# EAGLE design solar datalogger workshop (EAGLE 9.3.0)
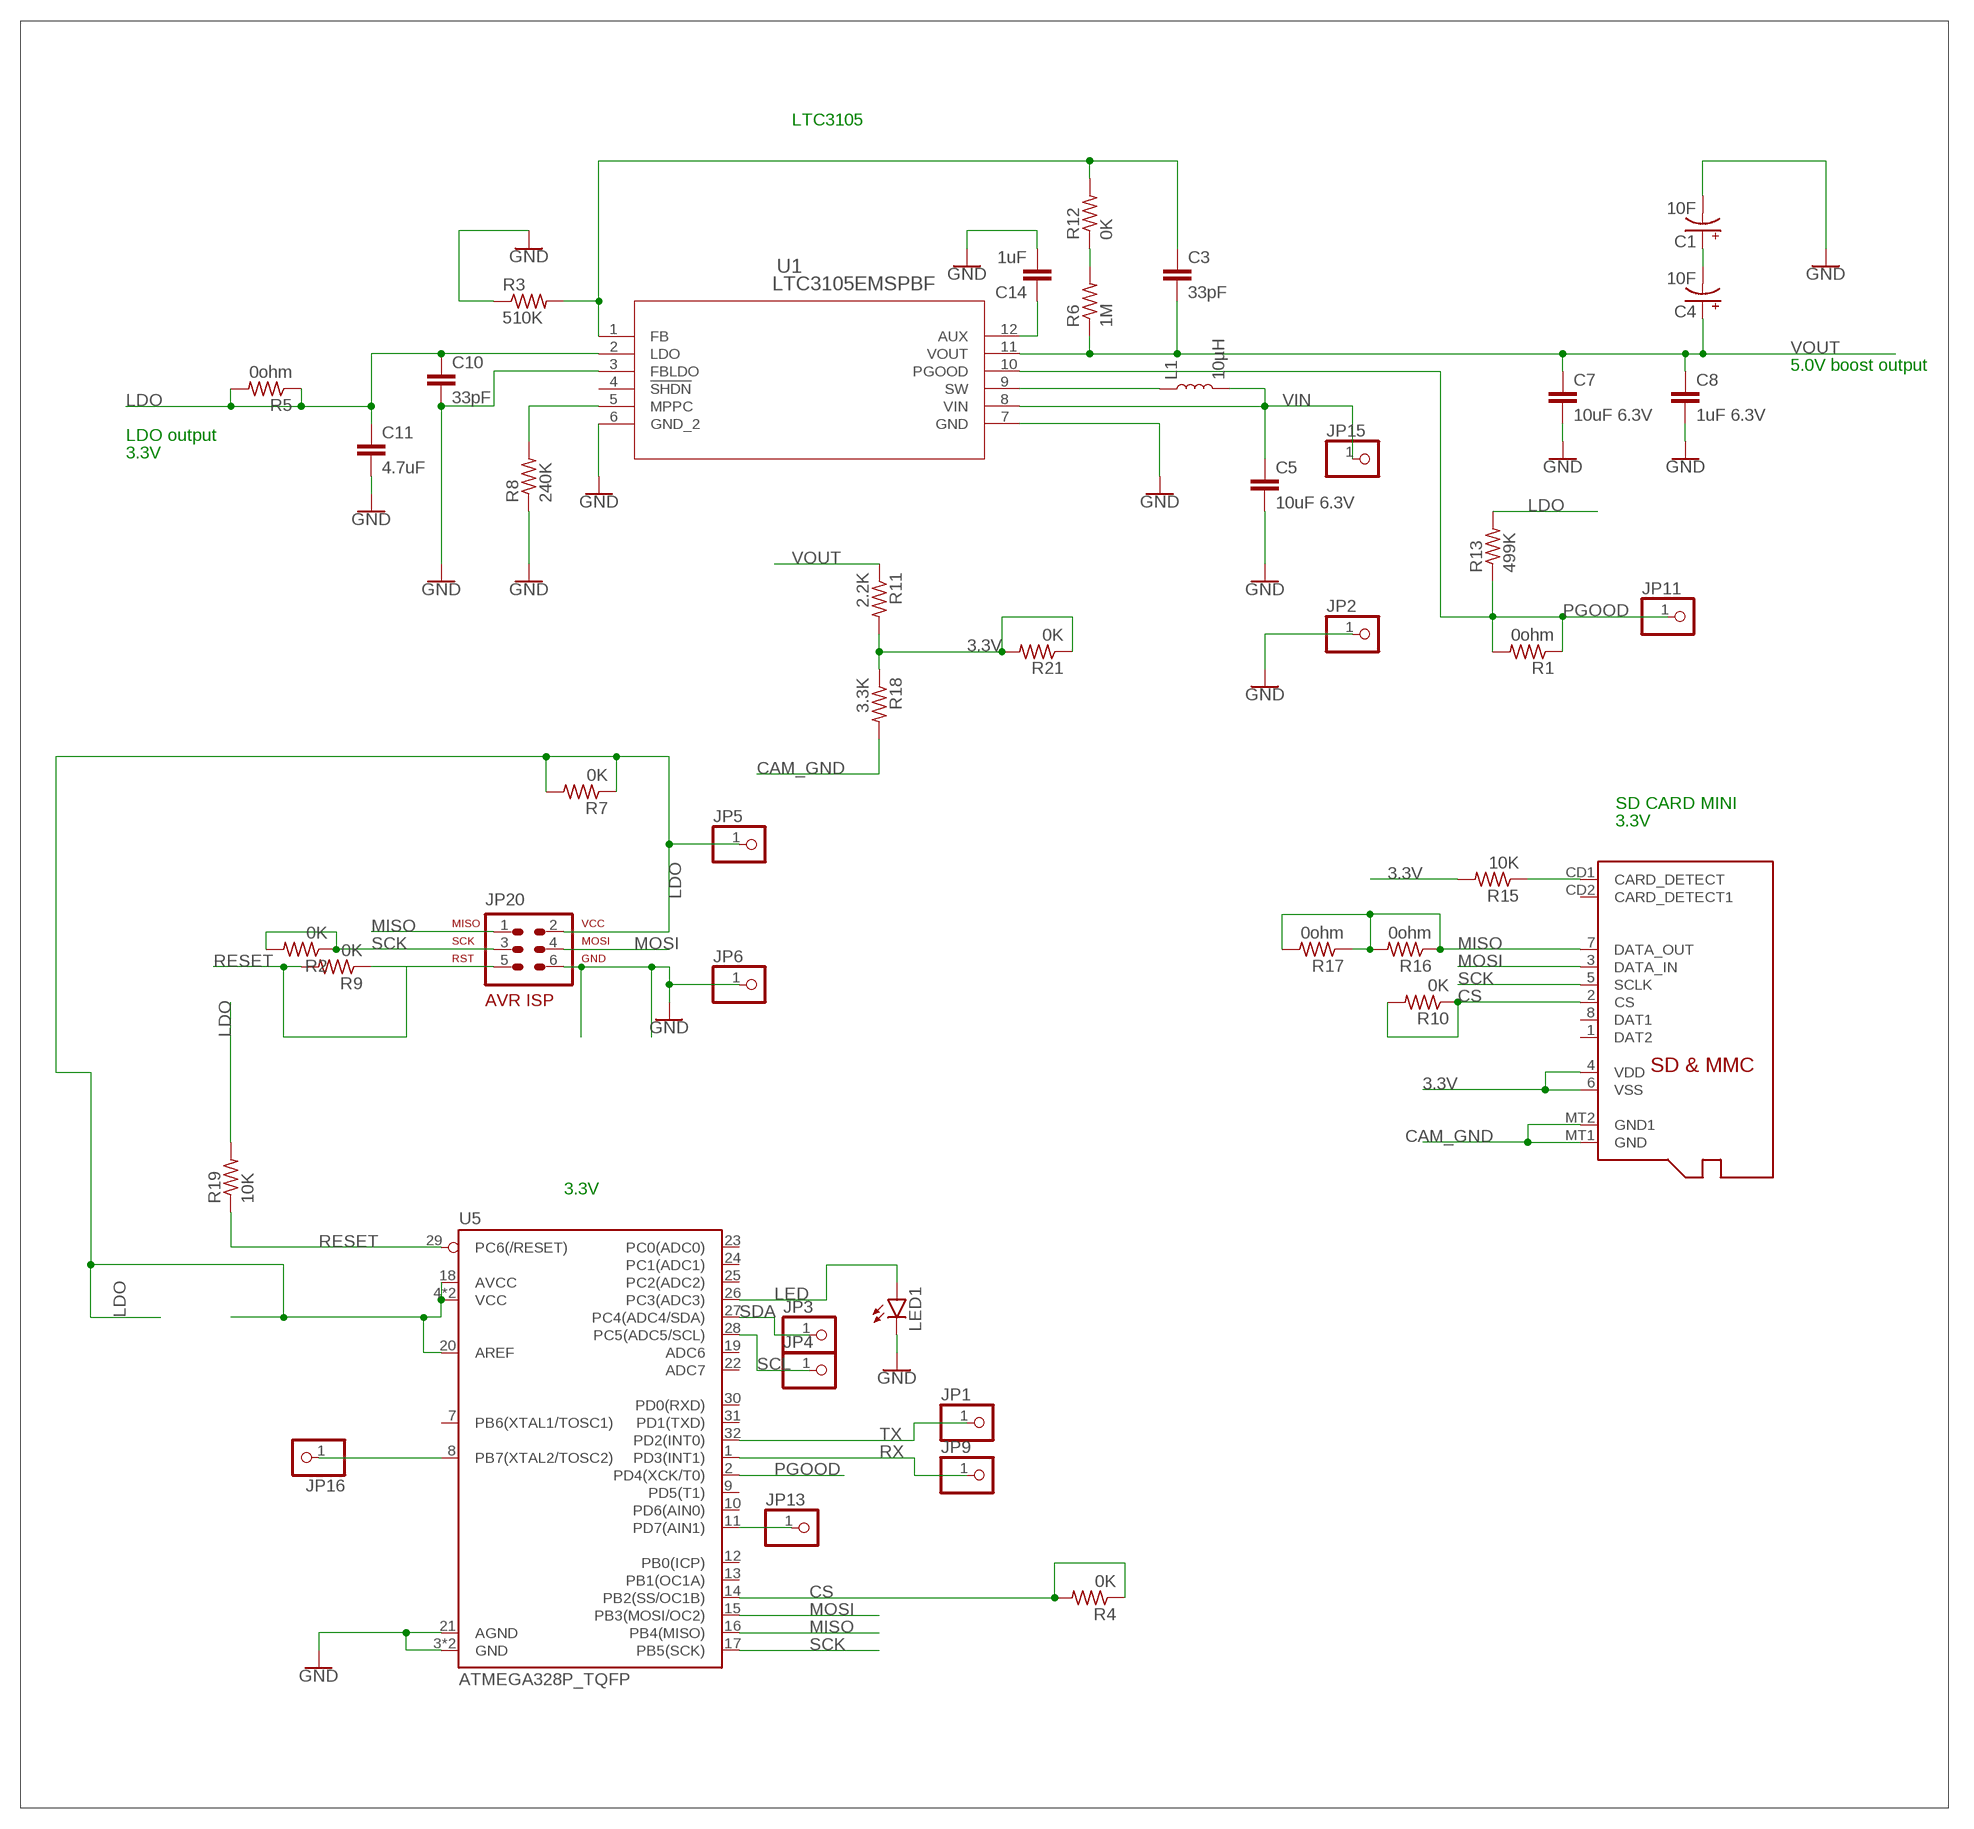
[diagram p0: schematic, sheet 1]

## Parts
C1  10F  1F-EDLC  [CAP-RADIAL-5MM-21.5MM]
C3  33pF  2.2UF-1206-50V-10%  [1206]
C4  10F  1F-EDLC  [CAP-RADIAL-5MM-21.5MM]
C5  10uF 6.3V  2.2UF-1206-50V-10%  [1206]
C7  10uF 6.3V  2.2UF-1206-50V-10%  [1206]
C8  1uF 6.3V  2.2UF-1206-50V-10%  [1206]
C10  33pF  2.2UF-1206-50V-10%  [1206]
C11  4.7uF  2.2UF-1206-50V-10%  [1206]
C14  1uF  2.2UF-1206-50V-10%  [1206]
JP1  PINHD-1X1CB  [1X01-CLEANBIG]
JP2  PINHD-1X1CB  [1X01-CLEANBIG]
JP3  PINHD-1X1CB  [1X01-CLEANBIG]
JP4  PINHD-1X1CB  [1X01-CLEANBIG]
JP5  PINHD-1X1CB  [1X01-CLEANBIG]
JP6  PINHD-1X1CB  [1X01-CLEANBIG]
JP9  PINHD-1X1CB  [1X01-CLEANBIG]
JP11  PINHD-1X1CB  [1X01-CLEANBIG]
JP13  PINHD-1X1CB  [1X01-CLEANBIG]
JP15  PINHD-1X1CB  [1X01-CLEANBIG]
JP16  PINHD-1X1CB  [1X01-CLEANBIG]
JP20  AVR-ISP-6HORZ  [AVR-ISP-6R]
L1  10µH  INDUCTOR-VLF4012AT-2.2UH  [INDUCTOR_2.2UH]
LED1  LEDSML1206  [SML1206]
R1  0ohm  R-US_R1206  [R1206]
R2  0K  R-US_R1206  [R1206]
R3  510K  R-US_R1206  [R1206]
R4  0K  R-US_R1206  [R1206]
R5  0ohm  R-US_R1206  [R1206]
R6  1M  R-US_R1206  [R1206]
R7  0K  R-US_R1206  [R1206]
R8  240K  R-US_R1206  [R1206]
R9  0K  R-US_R1206  [R1206]
R10  0K  R-US_R1206  [R1206]
R11  2.2K  R-US_R1206  [R1206]
R12  0K  R-US_R1206  [R1206]
R13  499K  R-US_R1206  [R1206]
R15  10K  R-US_R1206  [R1206]
R16  0ohm  R-US_R1206  [R1206]
R17  0ohm  R-US_R1206  [R1206]
R18  3.3K  R-US_R1206  [R1206]
R19  10K  R-US_R1206  [R1206]
R21  0K  R-US_R1206  [R1206]
U1  LTC3105EMSPBF  [MSOP-12_MS]
U5  ATMEGA328P_TQFP  [TQFP32-08]
U$1  MICROSD  [MICROSD]

## Nets
3.3V: R11.2 R15.2 R18.1 R21.1 R21.2 U$1.4(VDD) U$1.6(VSS)
CAM_GND: R18.2 U$1.MT1(GND) U$1.MT2(GND1)
CS: R4.1 R4.2 R10.1 R10.2 U5.14(PB2(SS/OC1B)) U$1.2(CS)
GND: C1.- C5.2 C7.2 C8.2 C10.2 C11.2 C14.2 JP2.1 JP6.1 JP20.6 LED1.C R3.1 R8.1 U1.3(FBLDO) U1.6(GND_2) U1.7(GND) U5.3(GND) U5.5(GND) U5.21(AGND)
LDO: C10.1 C11.1 JP5.1 JP20.2 R5.1 R5.2 R7.1 R7.2 R13.2 R19.2 U1.2(LDO) U5.4(VCC) U5.6(VCC) U5.18(AVCC) U5.20(AREF)
LED: LED1.A U5.26(PC3(ADC3))
MISO: JP20.1 R16.1 R16.2 R17.1 R17.2 U5.16(PB4(MISO)) U$1.7(DATA_OUT)
MOSI: JP20.4 U5.15(PB3(MOSI/OC2)) U$1.3(DATA_IN)
N$1: C3.1 R3.2 R12.2 U1.1(FB)
N$2: C1.+ C4.-
N$4: L1.P$1 U1.9(SW)
N$5: C14.1 U1.12(AUX)
N$6: R8.2 U1.5(MPPC)
N$7: R6.2 R12.1
N$8: JP13.1 U5.11(PD7(AIN1))
N$11: JP16.1 U5.8(PB7(XTAL2/TOSC2))
N$16: R15.1 U$1.CD1(CARD_DETECT)
PGOOD: JP11.1 R1.1 R1.2 R13.1 U1.10(PGOOD) U5.2(PD4(XCK/T0))
RESET: JP20.5 R9.1 R9.2 R19.1 U5.29(PC6(/RESET))
RX: JP9.1 U5.1(PD3(INT1))
SCK: JP20.3 R2.1 R2.2 U5.17(PB5(SCK)) U$1.5(SCLK)
SCL: JP4.1 U5.28(PC5(ADC5/SCL))
SDA: JP3.1 U5.27(PC4(ADC4/SDA))
TX: JP1.1 U5.32(PD2(INT0))
VIN: C5.1 JP15.1 L1.P$2 U1.8(VIN)
VOUT: C3.2 C4.+ C7.1 C8.1 R6.1 R11.1 U1.11(VOUT)
Unconnected: U1.4(!SHDN) U5.7(PB6(XTAL1/TOSC1)) U5.9(PD5(T1)) U5.10(PD6(AIN0)) U5.12(PB0(ICP)) U5.13(PB1(OC1A)) U5.19(ADC6) U5.22(ADC7) U5.23(PC0(ADC0)) U5.24(PC1(ADC1)) U5.25(PC2(ADC2)) U5.30(PD0(RXD)) U5.31(PD1(TXD)) U$1.1(DAT2) U$1.8(DAT1) U$1.CD2(CARD_DETECT1)

## Notes on the sheet
- LTC3105
- 5.0V boost output
- LDO output
- 3.3V
- SD CARD MINI
- 3.3V
- 3.3V

## Library data of the parts
C1 C4 = SparkFun-Capacitors:1F-EDLC: [Eaton] [KR-5R5C105-R] - [1F Electric Double Layer Capacitor (SuperCapacitor)] This is a 21.5mm OD 1F SuperCapacitor.; PROD_ID: CAP-13904
C3 C5 C7 C8 C10 C11 C14 = SparkFun-Capacitors:2.2UF: 2.2µF ceramic capacitors A capacitor is a passive two-terminal electrical component used to store electrical energy temporarily in an electric field.; PROD_ID: CAP-10009; VALUE: 2.2uF
JP1-JP6 JP9 JP11 JP13 JP15 JP16 = adafruit:PINHD-1X1: Pin header 1x1 for 0.1" spacing With round pins
JP20 = avr-7:AVR-ISP-6: AVR ISP-6 Serial Programming Header
L1 = SparkFun-Coils:INDUCTOR: Inductors Resist changes in electrical current. Basically a coil of wire. SparkFun Products: SparkFun Load Cell Amplifier - HX711 <https://www.sparkfun.com/products/13879> IOIO-OTG - V2.2 <https://www.sparkfun.com/products/13613>; PROD_ID: NDUC-09513; VALUE: 2.2µH/±20%/1.5A
LED1 = led:LED: LED OSRAM: - CHIPLED LG R971, LG N971, LY N971, LG Q971, LY Q971, LO R971, LY R971 LH N974, LH R974 LS Q976, LO Q976, LY Q976 LO Q996 - Hyper CHIPLED LW Q18S LB Q993, LB Q99A, LB R99A - SideLED LS A670, LO A670, LY A670, LG A670, LP A670 LB A673, LV A673, LT A673, LW A673 LH A674 LY A675 LS A676, LA A676, LO A676, LY A676, LW A676 LS A679, LY A679, LG A679 - Hyper Micro SIDELED® LS Y876, LA Y876, LO Y876, LY Y876 LT Y87S - SmartLED LW L88C, LW L88S LB L89C, LB L89S, LG L890 LS L89K, LO L89K, LY L89K LS L896, LA L896, LO L896, LY L896 - TOPLED LS T670, LO T670, LY T670, LG T670, LP T670 LSG T670, LSP T670, LSY T670, LOP T670, LYG T670 LG T671, LOG T671, LSG T671 LB T673, LV T673, LT T673, LW T673 LH T674 LS T676, LA T676, LO T676, LY T676, LB T676, LH T676, LSB T676, LW T676 LB T67C, LV T67C, LT T67C, LS T67K, LO T67K, LY T67K, LW E67C LS E67B, LA E67B, LO E67B, LY E67B, LB E67C, LV E67C, LT E67C LW T67C LS T679, LY T679, LG T679 LS T770, LO T770, LY T770, LG T770, LP T770 LB T773, LV T773, LT T773, LW T773 LH T774 LS E675, LA E675, LY E675, LS T675 LS T776, LA T776, LO T776, LY T776, LB T776 LHGB T686 LT T68C, LB T68C - Hyper Mini TOPLED® LB M676 - Mini TOPLED Santana® LG M470 LS M47K, LO M47K, LY M47K Source: http://www.osram.convergy.de LUXEON: - LUMILED® LXK2-PW12-R00, LXK2-PW12-S00, LXK2-PW14-U00, LXK2-PW14-V00 LXK2-PM12-R00, LXK2-PM12-S00, LXK2-PM14-U00 LXK2-PE12-Q00, LXK2-PE12-R00, LXK2-PE12-S00, LXK2-PE14-T00, LXK2-PE14-U00 LXK2-PB12-K00, LXK2-PB12-L00, LXK2-PB12-M00, LXK2-PB14-N00, LXK2-PB14-P00, LXK2-PB14-Q00 LXK2-PR12-L00, LXK2-PR12-M00, LXK2-PR14-Q00, LXK2-PR14-R00 LXK2-PD12-Q00, LXK2-PD12-R00, LXK2-PD12-S00 LXK2-PH12-R00, LXK2-PH12-S00 LXK2-PL12-P00, LXK2-PL12-Q00, LXK2-PL12-R00 Source: www.luxeon.com KINGBRIGHT: KA-3528ASYC Source: www.kingbright.com
R1-R13 R15-R19 R21 = adafruit:R-US_: RESISTOR, American symbol
U1 = ltc 3105:LTC3105EMSPBF; MANUFACTURER_PART_NUMBER: ltc3105ems#pbf; VENDOR: Linear Technology
U5 = SparkFun-IC-Microcontroller:ATMEGA328P_TQFP: Popular 328P in QFP Storefront component: ATmega328 - TQFP <https://www.sparkfun.com/products/13448> (COM-13448) Datasheet <http://www.sparkfun.com/datasheets/Components/SMD/ATMega328.pdf> SparkFun Products SparkFun RedBoard - Programmed with Arduino <https://www.sparkfun.com/products/12757> (DEV-12757) Arduino Pro Mini 328 - 5V/16MHz <https://www.sparkfun.com/products/11113> (DEV-11113) Arduino Pro Mini 328 - 3.3V/8MHz <https://www.sparkfun.com/products/11114> (DEV-11114) SparkFun OpenLog <https://www.sparkfun.com/products/13712> (DEV-13712) SparkFun MicroView - OLED Arduino Module <https://www.sparkfun.com/products/12923> (DEV-12923) SparkFun Digital Sandbox <https://www.sparkfun.com/products/12651> (DEV-12651) SparkFun PicoBoard <https://www.sparkfun.com/products/11888> (WIG-11888) Arduino Fio <https://www.sparkfun.com/products/10116> (DEV-10116) LilyPad Arduino 328 Main Board <https://www.sparkfun.com/products/13342> (DEV-13342) SparkFun RedStick <https://www.sparkfun.com/products/13741> (DEV-13741) LilyPad MP3 <https://www.sparkfun.com/products/11013> (DEV-11013) LilyPad Arduino SimpleSnap <https://www.sparkfun.com/products/10941> (DEV-10941) SparkFun Stepoko <https://www.sparkfun.com/products/13899> (ROB-13899) SparkFun Geiger Counter <https://www.sparkfun.com/products/11345> (SEN-11345) SparkFun EL Sequencer <https://www.sparkfun.com/products/12781> (COM-12781) Arduino Pro 328 - 5V/16MHz <https://www.sparkfun.com/products/10915> (DEV-10915) CryptoCape <https://www.sparkfun.com/products/12773> (DEV-12773) SparkFun IR Thermometer Evaluation Board - MLX90614 <https://www.sparkfun.com/products/10740> (SEN-10740) SparkFun RedBot Mainboard <https://www.sparkfun.com/products/12097> (ROB-12097) Arduino Pro 328 - 3.3V/8MHz <https://www.sparkfun.com/products/10914> (DEV-10914) SparkFun Block for Intel® Edison - Arduino <https://www.sparkfun.com/products/13036> (DEV-13036) SparkFun Simon Says - Surface Mount Soldering Kit <https://www.sparkfun.com/products/10935> (KIT-10935) SparkFun 7-Segment Serial Display - Red <https://www.sparkfun.com/products/11441> (COM-11441) SparkFun 7-Segment Serial Display - White <https://www.sparkfun.com/products/11629> (COM-11629) SparkFun 7-Segment Serial Display - Yellow <https://www.sparkfun.com/products/11443> (COM-11443) SparkFun 7-Segment Serial Display - Kelly Green <https://www.sparkfun.com/products/11440> (COM-11440) SparkFun 7-Segment Serial Display - Blue <https://www.sparkfun.com/products/11442> (COM-11442) SparkFun OpenSegment Serial Display - 20mm (Blue) <https://www.sparkfun.com/products/11647> (COM-11647) SparkFun OpenSegment Serial Display - 20mm (Green) <https://www.sparkfun.com/products/11646> (COM-11646) SparkFun OpenSegment Serial Display - 20mm (White) <https://www.sparkfun.com/products/11648> (COM-11648) SparkFun OpenSegment Serial Display - 20mm (Red) <https://www.sparkfun.com/products/11644> (COM-11644) SparkFun OpenSegment Serial Display - 20mm (Yellow) <https://www.sparkfun.com/products/11645> (COM-11645) SparkFun OpenSegment Shield <https://www.sparkfun.com/products/13190> (DEV-13190); PROD_ID: IC-09069
U$1 = adafruit:MICROSD: Micro-SD / Transflash card holder with SPI pinout For the 3M # 2908-05WB-MG and/or 4UCON #19656 push-push type

## Board
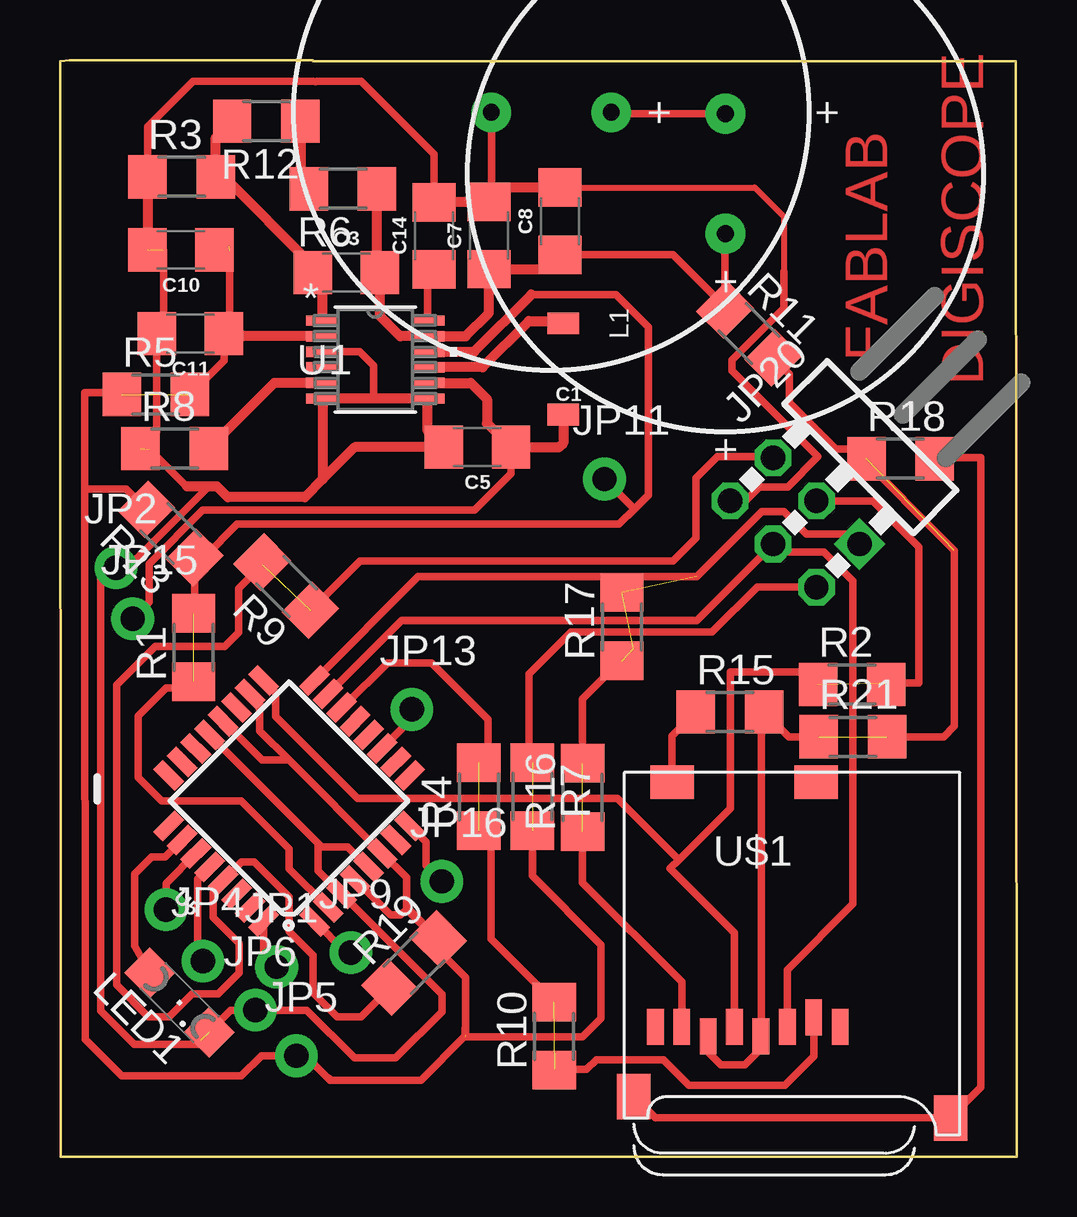
[diagram p1: board, top side]
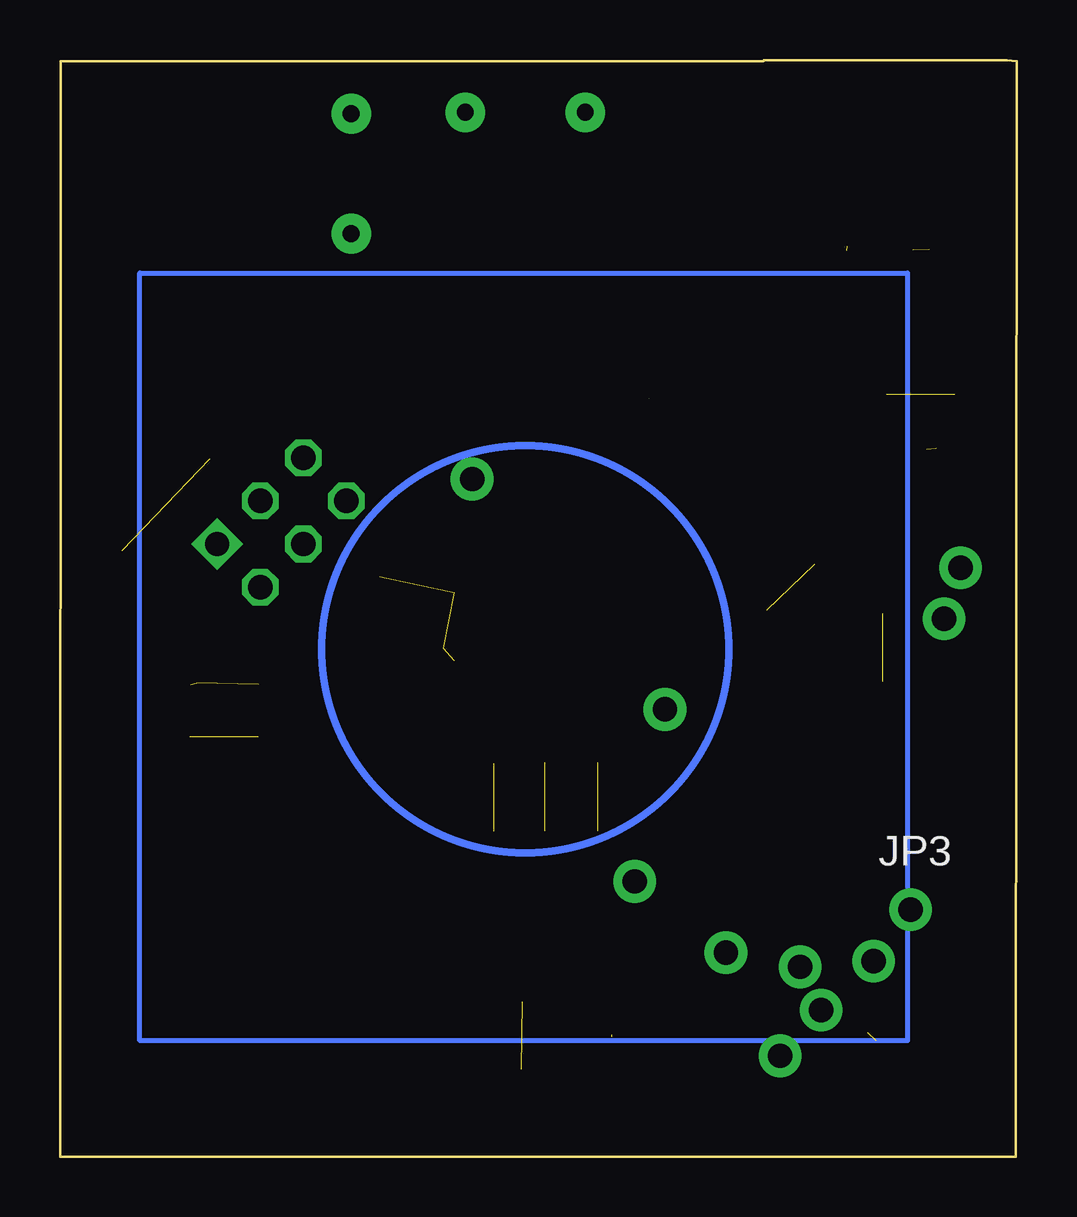
[diagram p2: board, bottom side, seen from below]

Size 39.88 x 45.72 mm. Coordinates in mm from the lower left corner, seen from the top.
Outline: 39.88,0 39.85,45.66 10.56,45.66 10.53,45.72 0.41,45.71 0,45.66 0.03,0 39.88,0
Copper layers (1*16): Top 0.035mm / dielectric 1.5mm / Bottom 0.035mm
Design rules "jonah *": minimum track width 10mil, minimum drill 0.1mm, track to track 0.1mm, track to pad 0.1mm, pad to pad 0.1mm, via to via 0.1mm, smd to smd 0.1mm, copper to edge 0.1mm, drill to drill 0.1mm, minimum pad ring 0.1mm, minimum via ring 8mil, stop-mask expansion 0.4mm, vias tented up to drill 0mil, thermal gap 0.4mm

### Footprints (pad centres in the part's own frame; a part is rotated, then mirrored left to right if it is on the bottom)
CAP-RADIAL-5MM-21.5MM = drill 0.7 pad 1.651: + -2.5,0; - 2.5,0
1206 = smd 1.6 x 1.8: 1 -1.4,0; 2 1.4,0
1X01-CLEANBIG = drill 1.016 pad 1.778: 1 0,0
AVR-ISP-6R = drill 1.016 square: 1 -2.54,-1.27 | drill 1.016 octagon: 2 -2.54,1.27; 3 0,-1.27; 4 0,1.27; 5 2.54,-1.27; 6 2.54,1.27
INDUCTOR_2.2UH = smd 0.9 x 1.3: P$1 -1.9,0; P$2 1.9,0
SML1206 = smd 1.5 x 1.5: A 1.75,0; C -1.75,0
R1206 = smd 1.6 x 1.803: 1 -1.422,0; 2 1.422,0
MSOP-12_MS = smd 1.397 x 0.432: 1 -2.184,1.626; 2 -2.184,0.975; 3 -2.184,0.325; 4 -2.184,-0.325; 5 -2.184,-0.975; 6 -2.184,-1.626; 7 2.184,-1.626; 8 2.184,-0.975; 9 2.184,-0.325; 10 2.184,0.325; 11 2.184,0.975; 12 2.184,1.626
TQFP32-08 = smd 1.27 x 0.559: 1 -4.293,2.8; 2 -4.293,2; 3 -4.293,1.2; 4 -4.293,0.4; 5 -4.293,-0.4; 6 -4.293,-1.2; 7 -4.293,-2; 8 -4.293,-2.8; 17 4.293,-2.8; 18 4.293,-2; 19 4.293,-1.2; 20 4.293,-0.4; 21 4.293,0.4; 22 4.293,1.2; 23 4.293,2; 24 4.293,2.8 | smd 0.559 x 1.27: 9 -2.8,-4.293; 10 -2,-4.293; 11 -1.2,-4.293; 12 -0.4,-4.293; 13 0.4,-4.293; 14 1.2,-4.293; 15 2,-4.293; 16 2.8,-4.293; 25 2.8,4.293; 26 2,4.293; 27 1.2,4.293; 28 0.4,4.293; 29 -0.4,4.293; 30 -1.2,4.293; 31 -2,4.293; 32 -2.8,4.293
MICROSD = smd 0.7 x 1.5: 1 9,-10.64; 2 7.9,-10.24; 3 6.8,-10.64; 4 5.7,-11.04; 5 4.6,-10.64; 6 3.5,-11.04; 7 2.4,-10.64; 8 1.3,-10.64 | smd 1.8 x 1.4: CD1 2,-0.44; CD2 8,-0.44 | smd 1.4 x 1.9: MT1 0.4,-13.54; MT2 13.6,-14.44

### Placement (x,y rotation side)
C1  20.48,43.54 180 top
C3  11.94,36.85 0 top
C4  27.74,40.98 90 top
C5  17.4,29.58 180 top
C7  17.88,38.4 90 top
C8  20.84,39 90 top
C10  5.04,37.8 180 top
C11  5.44,34.31 180 top
C14  15.59,38.39 90 top
JP1  9.03,7.92 0 top
JP2  2.34,24.56 0 top
JP3  4.42,10.3 0 bottom
JP4  5.96,8.16 0 top
JP5  9.86,4.21 0 top
JP6  8.15,6.11 0 top
JP9  12.12,8.51 0 top
JP11  22.7,28.25 0 top
JP13  14.66,18.65 0 top
JP15  3.03,22.43 0 top
JP16  15.92,11.48 0 top
JP20  30.64,26.44 135 top
L1  20.98,32.84 270 top
LED1  4.98,6.43 135 top
R1  5.57,21.23 90 top
R2  33.02,19.69 0 top
R3  5.07,40.85 0 top
R4  17.46,15.01 90 top
R5  4,31.78 0 top
R6  11.79,40.35 180 top
R7  19.69,15.01 270 top
R8  4.78,29.52 0 top
R9  9.44,23.78 135 top
R10  20.6,5.03 90 top
R11  28.73,34.31 315 top
R12  8.6,43.17 180 top
R13  4.61,25.99 135 top
R15  27.93,18.54 0 top
R16  21.79,14.98 90 top
R17  23.43,22.1 90 top
R18  35.04,29.1 0 top
R19  14.76,8.08 45 top
R21  33.05,17.51 0 top
U1  13.14,33.23 0 top
U5  9.55,14.84 135 top
U$1  23.52,16.06 0 top

### Tracks (layer width: path | path; a pad name or v marks a point on that pad's centre or on a via)
3.3V  (2 unrouted)
  Top 0.305: U$1.6 27.02,4.37 27.55,3.84 28.55,3.84 29.22,4.51 U$1.4 29.23,5.03 29.23,18.42 R15.2 30.38,17.51 R21.1 | R11.2 30.41,32.62 30.41,31.44 32.35,29.5 33.07,29.5 37.29,25.28 37.29,17.95 36.85,17.51 R21.2
CAM_GND
  Top 0.305: U$1.MT1 24.82,1.62 U$1.MT2 38.4,2.89 38.4,29.15 36.51,29.15 R18.2
CS  (2 unrouted)
  Top 0.305: U5.14 11.8,18.78 11.85,18.78 13.65,20.58 15.5,20.58 17.84,18.24 17.84,16.81 R4.2 | U$1.2 31.42,4.19 30.22,2.99 26.22,2.99 25.16,4.05 22.36,4.05 21.95,3.64 20.63,3.64 R10.1 | R4.1 17.97,13.08 17.97,9.08 R10.2
GND  (4 unrouted)
  Top 0.254: C8.2 28.96,40.4 30.18,39.19 30.18,36.91
  Top 0.305: 5.29,27.94 3.74,29.49 | R3.1 3.65,42.94 5.55,44.84 10.56,44.84 10.66,44.81 10.72,44.84 12.55,44.84 15.59,41.8 C14.2 | R8.1 4.04,30.2 C11.2 4.32,34.59 4.32,37.79 | U1.3 12.49,33.55 13.07,32.98 13.07,31.61 | U5.21 10.77,13.06 | 10.77,13.06 10.9,12.92 11.98,12.92 12.81,12.09 U5.5 | 10.77,13.06 10.77,11.93 U5.3 15.92,6.77 15.92,6.05 13.99,4.12 12.27,4.12 10.28,6.11 JP6.1 7.12,6.11 5.87,4.86 5.87,4.69 3.1,4.69 1.7,6.09 1.7,10.84 1.7,24.59 2.31,24.59 JP2.1 2.34,24.37 2.48,24.23 6.19,27.94 6.55,27.94 | JP20.6 28.58,27.34 29.16,27.92 30.34,27.92 31.6,29.18 28,32.78 28,33.21 30.12,35.34 30.12,35.29 30.18,35.34 30.18,36.91 | C1.- 17.98,39.9 C7.2
  Top 0.406: 10.96,28.25 12.29,29.58 C5.2 15.32,30.26 U1.7 13.07,31.61 U1.6 10.96,28.25 | 5.29,27.94 6.55,27.94 6.99,27.5 10.21,27.5 10.96,28.25 | 3.74,29.49 3.79,29.54 | 3.36,29.3 R8.1 | R3.1 C10.2 | C8.2 18.48,40.4 C7.2 C14.2
LDO  (4 unrouted)
  Top 0.305: 1.03,27.84 1.03,31.86 2.5,31.86 R5.1 | 1.03,27.84 1.03,24.84 1.05,4.89 2.57,3.37 7.56,3.37 8.4,4.21 JP5.1 | 7.06,37.96 6.6,37.96 C10.1 | R5.2 6.84,33.2 C11.1 7.08,34.55 7.08,34.74 7.08,37.78 | R13.2 2.76,27.84 1.03,27.84 | 9.55,16.54 U5.6 14.44,11.65 14.44,10.41 | 9.55,16.54 8.33,17.76 8.33,19.06 8.1,19.29 U5.18 | U5.20 8.42,16.54 9.55,16.54 | U5.4 12.34,11.52 13.79,10.08 14.21,10.08 14.44,10.31 14.44,10.41 | R19.2 15.68,9.08 14.64,10.13 | R19.2 15.55,9.08 | R19.2 14.44,10.41 | JP5.1 9.74,4.21 | 11.21,3.27 11.29,3.2 | JP5.1 10.24,4.21 11.26,3.2 11.29,3.2 | 9.7,4.21 JP5.1 | R19.2 15.76,8.63 16.9,7.49 16.9,5.08 | 31.51,23.72 JP20.2 29.06,23.75 27.19,21.87 21.3,21.87 19.55,20.12 19.55,16.57 R7.1 | 16.9,5.36 16.9,5 | R7.2 19.69,11.7 22.55,8.84 22.55,5.77 21.78,5 16.9,5 | 11.29,3.2 15.04,3.2 16.85,5 16.9,5
  Top 0.406: U1.2 7.62,34.2 7.08,34.74
LED
  Top 0.305: U5.26 4.39,12.51 3.83,12.51 3.12,11.8 3.12,8.8 LED1.A
MISO  (4 unrouted)
  Top 0.305: U5.16 14.94,24.19 26.55,24.19 29.25,26.89 30.17,26.89 31.11,25.95 32.92,25.95 JP20.1 33.4,25.54 | U$1.7 25.92,7.29 21.79,11.42 R16.1 | R16.2 21.79,19.08 23.9,21.19
MOSI
  Top 0.305: U5.15 14.23,22.35 26.55,22.35 JP20.4 30.07,25.21 31.84,25.21 33.06,23.99 33.06,10.54 30.32,7.8 U$1.3
N$1
  Top 0.406: U1.1 10.96,36.36 10.51,36.8 10.51,36.88 | 10.51,36.88 C3.1 | R12.2 6.49,42.48 R3.2 6.84,40.85 10.51,37.17 10.51,36.88
N$2
  Top 0.305: C4.- 23.04,43.48 C1.+
N$4
  Top 0.406: U1.9 17.62,32.91 19.55,34.84 20.88,34.84 L1.P$1
N$5
  Top 0.305: U1.12 15.32,36.72 C14.1
N$6
  Top 0.406: U1.5 8.94,32.25 R8.2
N$7
  Top 0.406: R12.1 10.02,40.7 R6.2
N$8
  Top 0.305: U5.11 14.66,18.25 JP13.1
N$11
  Top 0.305: U5.8 14.6,13.79 15.26,13.12 15.26,12.14 JP16.1
N$12
  Bottom 0.2: 36.55,4.84 36.55,36.84 4.55,36.84 4.55,4.84 36.55,4.84
N$16
  Top 0.305: 26.08,15.62 U$1.CD1 25.52,17.55 R15.1
PGOOD  (1 unrouted)
  Top 0.305: R13.1 6,24.98 7.39,26.37 23.31,26.37 23.97,27.03 | 5.36,24.73 R13.1 | 19.65,35.94 23.18,35.94 24.53,34.59 24.53,27.59 23.97,27.03 | JP11.1 23.92,27.03 23.97,27.03 | U5.2 9.55,12.01 9.55,12.84 7.55,14.84 4.24,14.84 3.26,15.82 3.26,18.38 4.42,19.54 5.3,19.54 R1.1 | R13.1 5.62,22.7 R1.2
  Top 0.406: U1.10 17.27,33.55 19.65,35.94
RESET  (1 unrouted)
  Top 0.305: U5.29 7.58,12.3 8.09,12.3 9.55,10.84 9.55,9.4 10.55,8.4 10.55,6.84 11.55,5.84 12.55,5.84 13.75,7.04 R19.1 | 6.73,11.52 U5.29 | R9.2 8.43,24.69 7.44,23.7 7.44,21.85 6.87,21.28 3.96,21.28 2.36,19.67 2.36,7.16 3.68,5.84 4.55,5.84 5.51,6.8 6.59,6.8 7.47,7.68 7.47,8.89 6.38,9.98 6.38,11 6.8,11.41 U5.29 | R9.1 12.5,24.84 25.55,24.84 26.51,25.8 26.51,28.3 27.4,29.19 29.68,29.19 JP20.5 | 6.78,11.52 U5.29
RX
  Top 0.305: 10.58,9.83 U5.1 11.92,8.51 JP9.1
SCK  (2 unrouted)
  Top 0.305: U5.17 8.99,19.35 8.99,18.36 12.41,14.95 23.24,14.95 25.8,12.38 | JP20.3 33.88,27.34 35.81,25.41 35.81,19.76 34.18,19.76 | U$1.5 28.12,9.33 25.43,12.01 25.8,12.38 | R2.1 31.08,20.21 27.95,20.21 27.95,14.53 25.8,12.38
SCL
  Top 0.305: JP4.1 5.73,8.39 5.73,11.59 U5.28
SDA
  Top 0.305: U5.27 4.42,11.41 JP3.1
TX
  Top 0.305: JP1.1 8.49,8.46 U5.32
VIN
  Top 0.305: JP15.1 3.72,23.12 3.72,24.71 5.96,26.95 17.28,26.95 18.8,28.47 C5.1
  Top 0.406: U1.8 17.13,32.25 17.8,31.59 17.8,30.58 C5.1 20.8,29.58 20.98,29.76 L1.P$2
VOUT
  Top 0.305: C8.1 25.55,37.6 27.72,35.43 R11.1 27.72,38.46 C4.+
  Top 0.406: C8.1 20.24,37 C7.1 17.88,35.17 16.91,34.2 U1.11 14.19,34.2 13.34,35.05 C3.2 13.21,36.98 R6.1
(copper drawn outside any net)
  shapes: Bottom circle x1

### Text on the board
Top: FABLAB | DIGISCOPE